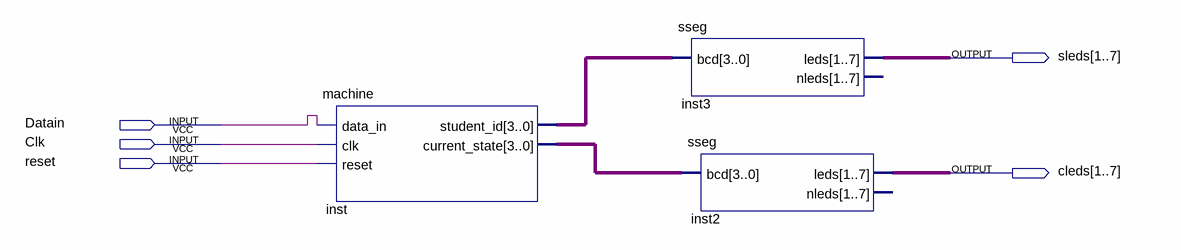
[diagram p0: schematic sheet]
// Quartus schematic Stinky_Doodoo.bdf as structural Verilog: 3 symbols, 5 pins
module Stinky_Doodoo (
  input  Datain,
  input  Clk,
  input  reset,
  output [1:7] sleds,
  output [1:7] cleds
);

  wire [3:0] inst_current_state, inst_student_id;

  machine inst (
    .data_in(Datain), .clk(Clk), .reset(reset), .student_id(inst_student_id),
    .current_state(inst_current_state));
  sseg inst3 (.bcd(inst_student_id), .leds(sleds));  // open: nleds
  sseg inst2 (.bcd(inst_current_state), .leds(cleds));  // open: nleds
endmodule
